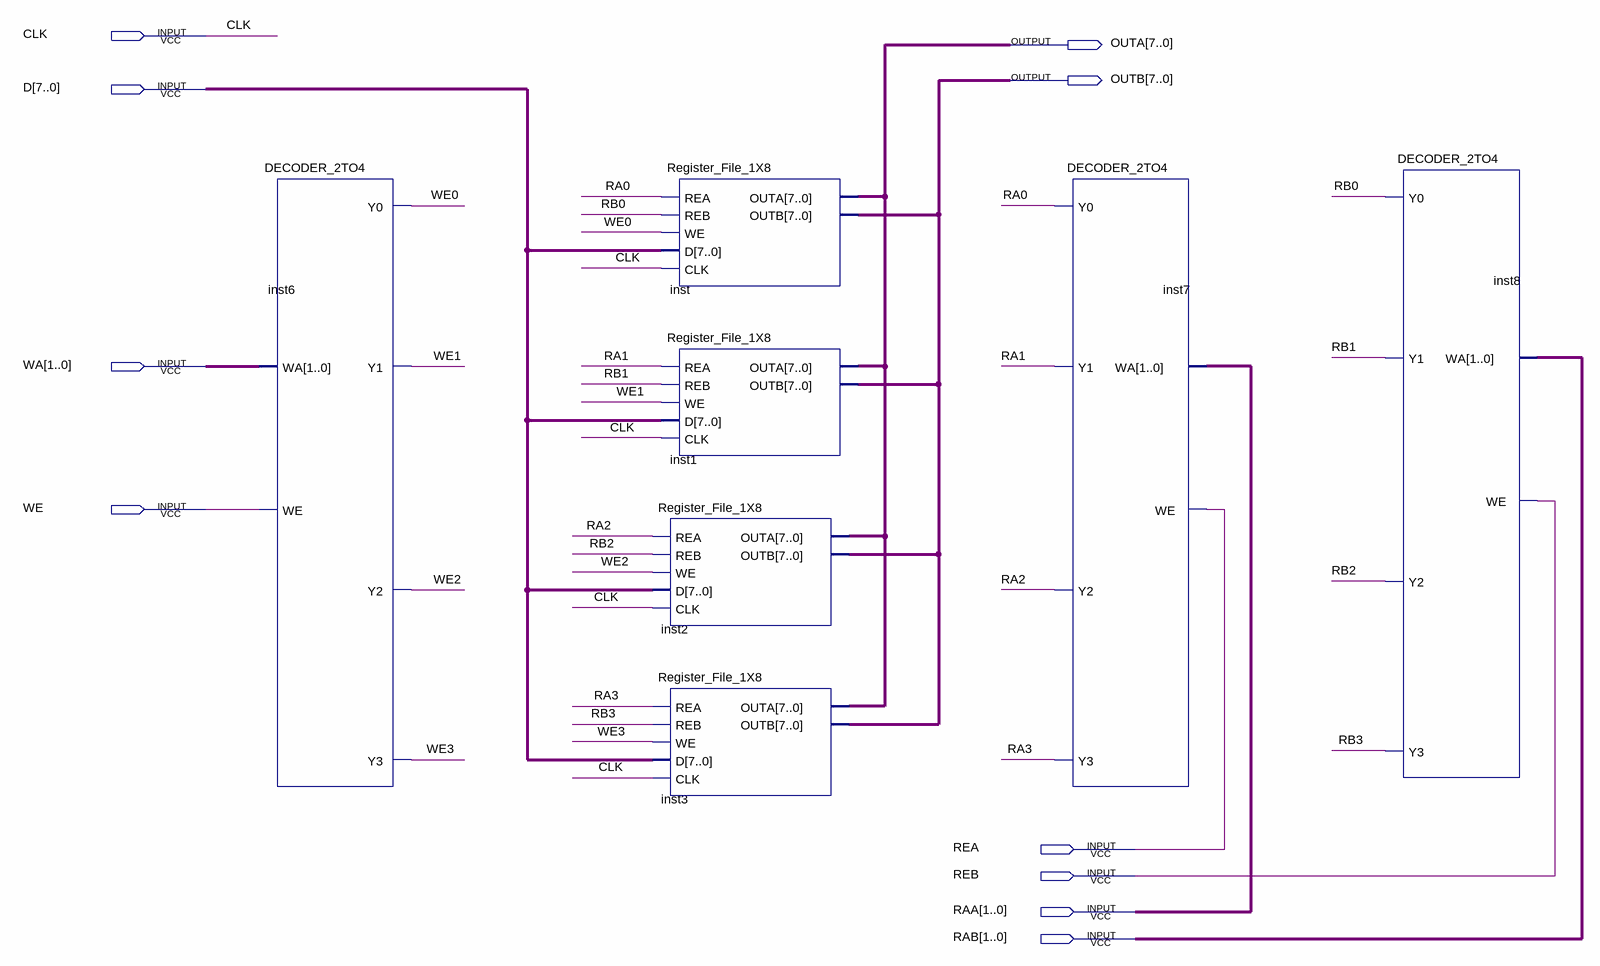
[diagram p0: schematic sheet]
// Quartus schematic Register_File_4X8.bdf as structural Verilog: 7 symbols, 10 pins
module Register_File_4X8 (
  input  CLK,
  input  [7:0] D,
  input  [1:0] WA,
  input  WE,
  input  REA,
  input  REB,
  input  [1:0] RAA,
  input  [1:0] RAB,
  output [7:0] OUTA,
  output [7:0] OUTB
);

  wire RA0, RA1, RA2, RA3, RB0, RB1, RB2, RB3, WE0, WE1, WE2, WE3;

  DECODER_2TO4 inst6 (.WA(WA), .WE(WE), .Y0(WE0), .Y1(WE1), .Y2(WE2), .Y3(WE3));
  Register_File_1X8 inst (.REA(RA0), .REB(RB0), .WE(WE0), .D(D), .CLK(CLK), .OUTA(OUTA), .OUTB(OUTB));
  Register_File_1X8 inst1 (.REA(RA1), .REB(RB1), .WE(WE1), .D(D), .CLK(CLK), .OUTA(OUTA), .OUTB(OUTB));
  Register_File_1X8 inst2 (.REA(RA2), .REB(RB2), .WE(WE2), .D(D), .CLK(CLK), .OUTA(OUTA), .OUTB(OUTB));
  Register_File_1X8 inst3 (.REA(RA3), .REB(RB3), .WE(WE3), .D(D), .CLK(CLK), .OUTA(OUTA), .OUTB(OUTB));
  DECODER_2TO4 inst7 (.WA(RAA), .WE(REA), .Y0(RA0), .Y1(RA1), .Y2(RA2), .Y3(RA3));
  DECODER_2TO4 inst8 (.WA(RAB), .WE(REB), .Y0(RB0), .Y1(RB1), .Y2(RB2), .Y3(RB3));
endmodule
